# EAGLE design T5400_Barometer_Breakout (EAGLE 6.0)
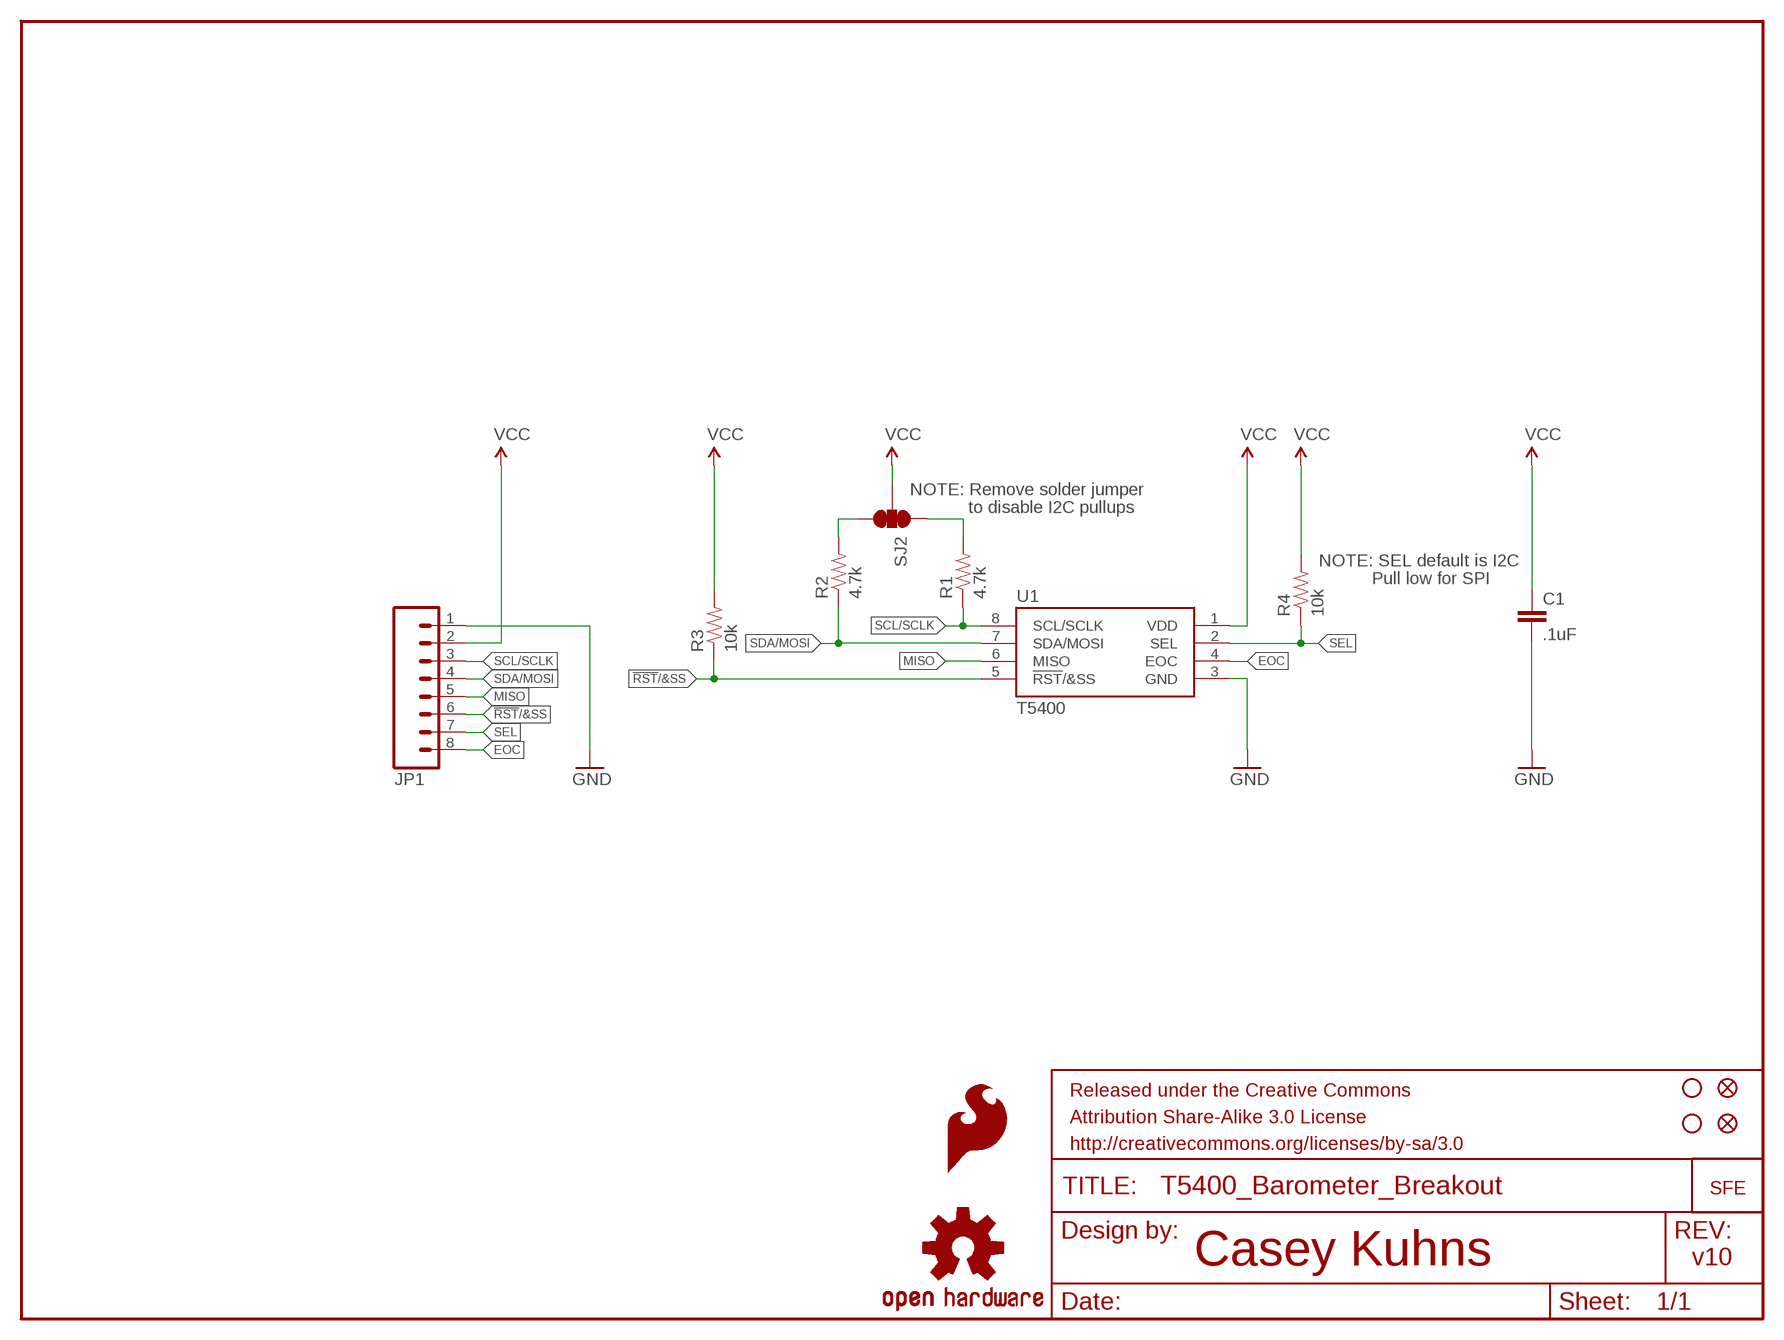
[diagram p0: schematic, sheet 1]

## Parts
C1  .1uF  0.1UF-25V-5%(0603)  [0603-CAP]
FID1  FIDUCIAL1X2  [FIDUCIAL-1X2]
FID2  FIDUCIAL1X2  [FIDUCIAL-1X2]
FRAME1  FRAME-LETTER  [CREATIVE_COMMONS]
JP1  M081X08  [1X08]
LOGO1  LOGO-SFENEW  [SFE-NEW-WEBLOGO]
LOGO2  OSHW-LOGOS  [OSHW-LOGO-S]
LOGO3  SFE_LOGO_FLAME.1_INCH  [SFE_LOGO_FLAME_.1]
R1  4.7k  RESISTOR0603-RES  [0603-RES]
R2  4.7k  RESISTOR0603-RES  [0603-RES]
R3  10k  RESISTOR0603-RES  [0603-RES]
R4  10k  RESISTOR0603-RES  [0603-RES]
SJ2  SOLDERJUMPER_2WAYPASTE1&2&3  [SJ_3_PASTE1&2&3]
STANDOFF1  STAND-OFF  [STAND-OFF]
STANDOFF2  STAND-OFF  [STAND-OFF]
U1  T5400  [T5400]

## Nets
!RST!/&SS: JP1.6 R3.1 U1.5(!RST!/&SS)
EOC: JP1.8 U1.4(EOC)
GND: C1.2 JP1.1 U1.3(GND)
MISO: JP1.5 U1.6(MISO)
N$1: R2.2 SJ2.3
N$2: R1.2 SJ2.1
SCL/SCLK: JP1.3 R1.1 U1.8(SCL/SCLK)
SDA/MOSI: JP1.4 R2.1 U1.7(SDA/MOSI)
SEL: JP1.7 R4.1 U1.2(SEL)
VCC: C1.1 JP1.2 R3.2 R4.2 SJ2.2 U1.1(VDD)

## Notes on the sheet
- NOTE: Remove solder jumper
- to disable I2C pullups
- NOTE: SEL default is I2C
- Pull low for SPI
- Casey Kuhns | v10

## Library data of the parts
C1 = SparkFun-Capacitors:0.1UF-25V-5%(0603): CAP-08604; PROD_ID: CAP-08604; VALUE: 0.1uF
FID1 FID2 = SparkFun-Aesthetics:FIDUCIAL: Fiducial Alignment Points Various fiducial points for machine vision alignment.
FRAME1 = SparkFun-Aesthetics:FRAME-LETTER: Schematic Frame Standard 8.5x11 US Letter frame
JP1 = SparkFun-Connectors:M08: Header 8 Standard 8-pin 0.1" header. Use with straight break away headers (SKU : PRT-00116), right angle break away headers (PRT-00553), swiss pins (PRT-00743), machine pins (PRT-00117), and female headers (PRT-00115).
LOGO1 = SparkFun-Aesthetics:LOGO-SFE: Spark Fun Electronics PCB Logo This is the standard Spark Fun Electronics PCB logo.
LOGO2 = SparkFun-Aesthetics:OSHW-LOGO: Open Source Hardware Logo This logo indicates the piece of hardware it is found on incorporates a OSHW license and/or adheres to the definition of open source hardware found here: http://freedomdefined.org/OSHW
LOGO3 = SparkFun-Aesthetics:SFE_LOGO_FLAME: SFE Logo, flame only This is the SparkFun flame logo. The logo on the schematic will always be the same size; the package variant is the height of the flame. Default layer for the logo on the board is tSilk.
R1-R4 = SparkFun-Passives:RESISTOR: Resistor Basic schematic elements and footprints for 0603, 1206, and PTH resistors.
SJ2 = SparkFun-Passives:SOLDERJUMPER_2WAY: Solder Jumper 2 way solder jumper
STANDOFF1 STANDOFF2 = SparkFun-Electromechanical:STAND-OFF: #4 Stand Off This is the mechanical footprint for a #4 phillips button head screw. Use the keepout ring to avoid running the screw head into surrounding components. SKU : PRT-00447
U1 = T5400:T5400

## Board
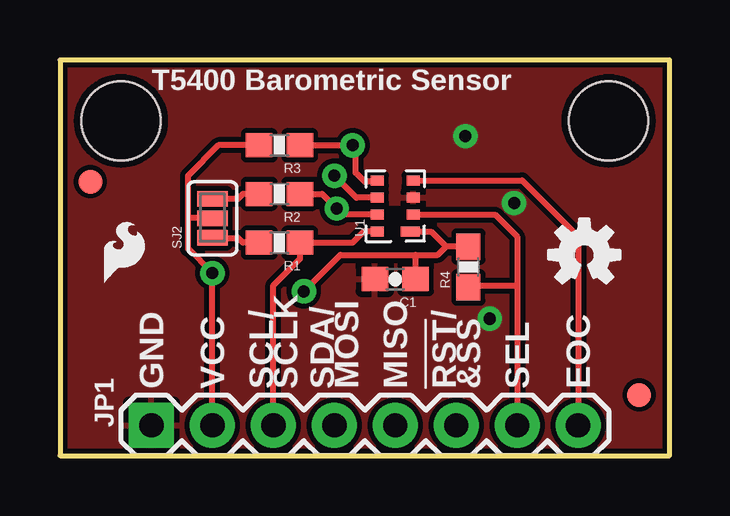
[diagram p1: board, top side]
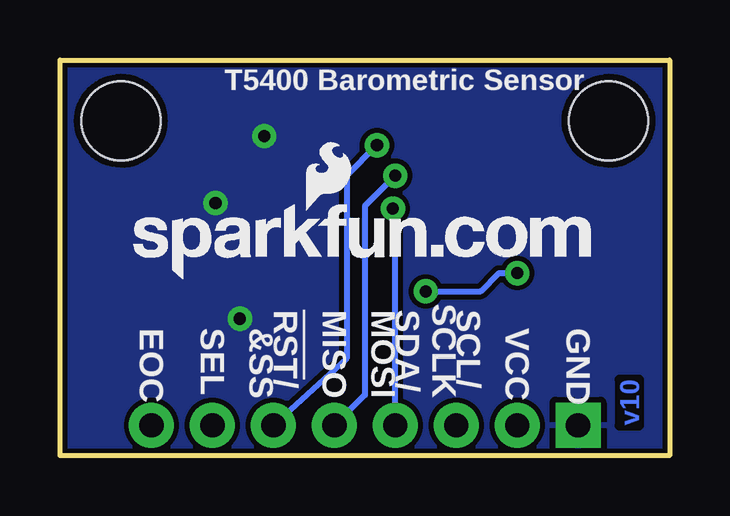
[diagram p2: board, bottom side, seen from below]

Size 25.4 x 16.51 mm. Coordinates in mm from the lower left corner, seen from the top.
Outline: 0,0 25.4,0 25.4,16.51 0,16.51 0,0
Copper layers (1*16): Top 0.035mm / dielectric 1.5mm / Bottom 0.035mm
Design rules: minimum track width 7mil, minimum drill 15mil, track to track 8mil, track to pad 8mil, pad to pad 8mil, via to via 8mil, smd to smd 8mil, copper to edge 8mil, drill to drill 8mil, minimum pad ring 12mil, minimum via ring 10mil, stop-mask expansion 4mil, vias tented up to drill 20mil, thermal gap 10mil
tRestrict: area 13.7,8.9 to 14,9.7; area 13.7,9.7 to 14.2,10.4

### Footprints (pad centres in the part's own frame; a part is rotated, then mirrored left to right if it is on the bottom)
0603-CAP = smd 1.1 x 1: 1 -0.85,0; 2 0.85,0
FIDUCIAL-1X2 = smd 1 x 1: 1 0,0
1X08 = drill 1.016 pad 1.88 square: 1 0,0 | drill 1.016 pad 1.88: 2 2.54,0; 3 5.08,0; 4 7.62,0; 5 10.16,0; 6 12.7,0; 7 15.24,0; 8 17.78,0
0603-RES = smd 1.1 x 1: 1 -0.85,0; 2 0.85,0
SJ_3_PASTE1&2&3 = smd 0.635 x 1.27: 1 -0.813,0; 2 0,0; 3 0.813,0
STAND-OFF = hole 3.302: 0,0
T5400 = smd 0.42 x 0.8: 1 -1.065,-0.625 | smd 0.42 x 0.55: 2 -0.355,-0.75; 3 0.355,-0.75; 4 1.065,-0.75; 5 1.065,0.75; 6 0.355,0.75; 7 -0.355,0.75; 8 -1.065,0.75

### Placement (x,y rotation side)
C1  13.97,7.37 180 top
FID1  1.27,11.43 0 top
FID2  24.13,2.54 0 top
FRAME1  0,-8.89 0 top  (outside the outline)
JP1  3.81,1.27 0 top
LOGO1  22.35,7.37 0 bottom
LOGO2  21.84,8.38 0 top
LOGO3  1.52,6.86 0 top
R1  9.14,8.89 180 top
R2  9.14,10.92 180 top
R3  9.14,12.95 180 top
R4  17.02,7.87 90 top
SJ2  6.35,9.91 90 top
STANDOFF1  2.54,13.97 0 top
STANDOFF2  22.86,13.97 0 top
U1  13.97,10.41 90 top

### Tracks (layer width: path | path; a pad name or v marks a point on that pad's centre or on a via)
!RST!/&SS  (via drill 0.51)
  Top 0.254: R3.1 v12.19,12.95 12.32,12.83 12.32,11.81 12.7,11.43 13.17,11.43 U1.5
  Bottom 0.254: v12.19,12.95 13.46,11.68 13.46,4.06 JP1.6
EOC
  Top 0.254: U1.4 19.25,11.48 21.59,9.14 JP1.8
GND  (via drill 0.51)
  other vias: 18.92,10.54 17.91,5.71 16.89,13.34
  pour Top: 0,0 25.4,0 25.4,16.51 0,16.51
  pour Bottom: 0,0 25.4,0 25.4,16.51 0,16.51
MISO  (via drill 0.51)
  Top 0.254: U1.6 12.35,10.77 v11.43,11.68
  Bottom 0.254: v11.43,11.68 12.7,10.41 12.7,2.54 JP1.5
N$1
  Top 0.254: R2.2 7.62,10.92 7.42,10.72 SJ2.3
N$2
  Top 0.254: R1.2 7.62,8.89 7.42,9.09 SJ2.1
SCL/SCLK
  Top 0.254: U1.8 12.65,9.35 12.19,8.89 R1.1 9.99,8.22 8.89,7.11 JP1.3
SDA/MOSI  (via drill 0.51)
  Top 0.254: R2.1 10.92,10.92 v11.53,10.31 11.79,10.06 U1.7
  Bottom 0.254: JP1.4 11.43,10.41 v11.53,10.31
SEL
  Top 0.254: U1.2 18.14,10.06 19.05,9.14 19.05,7.11 | 19.05,7.11 JP1.7 | R4.1 17.02,7.11 19.05,7.11
VCC  (via drill 0.51)
  Top 0.254: R3.2 6.6,12.95 5.33,11.68 5.33,9.91 | JP1.2 v6.35,7.62 5.33,8.64 5.33,9.91 | SJ2.2 5.33,9.91 | v10.16,6.86 11.68,8.38 14.82,8.38 | 14.82,8.38 15.75,8.38 16.09,8.72 | R4.2 16.09,8.72 | C1.1 14.82,8.38 | U1.1 15.46,9.35 16.09,8.72
  Bottom 0.254: v10.16,6.86 7.87,6.86 7.11,7.62 v6.35,7.62

### Text on the board
Bottom: v10
tPlace: T5400 Barometric Sensor | GND | VCC | SCL/ | SCLK | SDA/ | MOSI | MISO | !RST!/ | &SS | SEL | EOC
bPlace: T5400 Barometric Sensor | SCL/ | SCLK | SDA/ | MOSI | MISO | !RST!/ | GND | VCC | &SS | SEL | EOC
tNames: Casey Kuhns